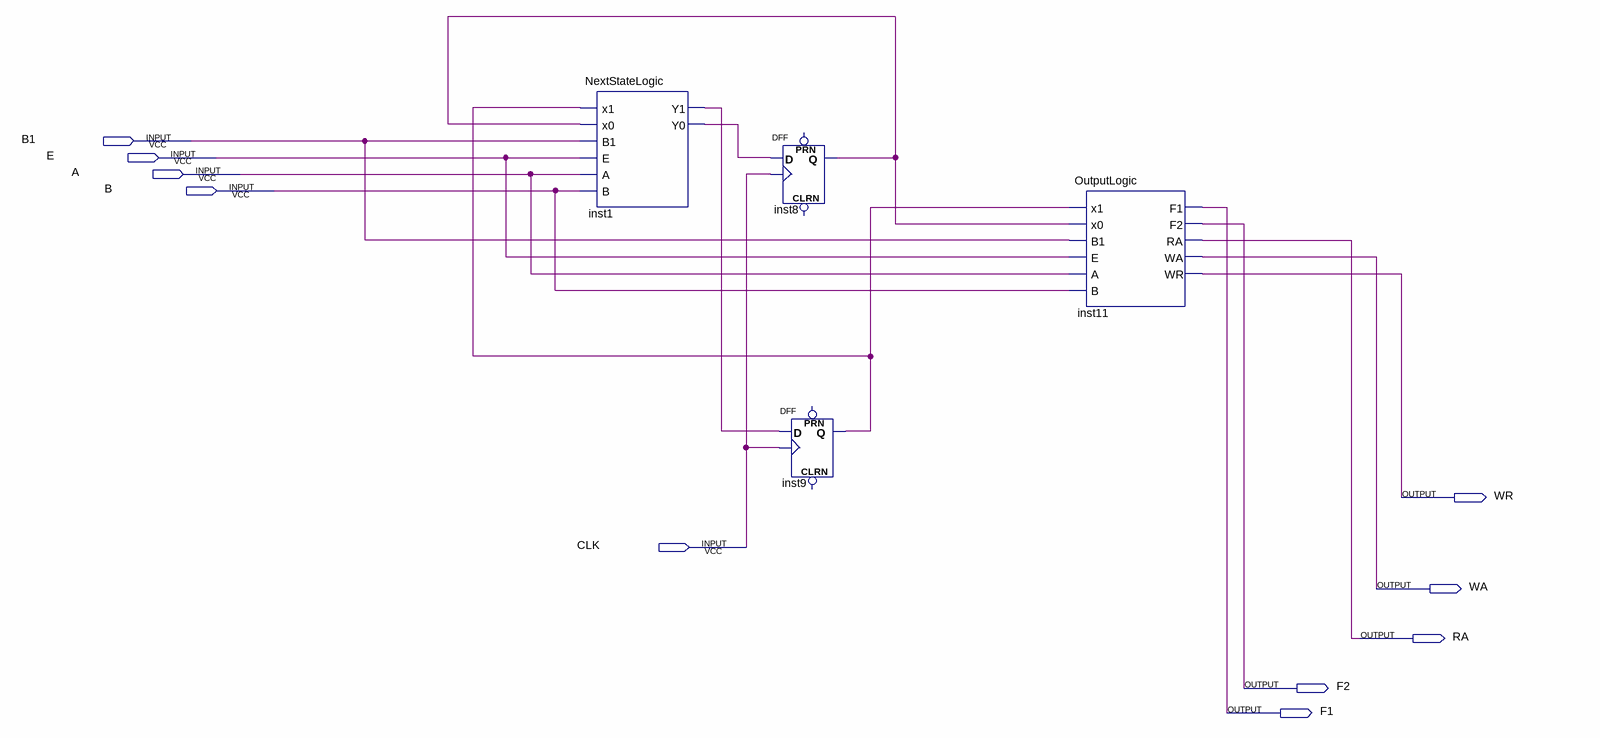
[diagram p0: schematic sheet]
// Quartus schematic FSM.bdf as structural Verilog: 4 symbols, 10 pins
module FSM (
  input  B1,
  input  E,
  input  A,
  input  B,
  input  CLK,
  output WR,
  output WA,
  output RA,
  output F2,
  output F1
);

  wire inst1_y0, inst1_y1, inst8_q, inst9_q;

  NextStateLogic inst1 (.x1(inst9_q), .x0(inst8_q), .B1(B1), .E(E), .A(A), .B(B), .Y1(inst1_y1), .Y0(inst1_y0));
  DFF inst8 (.CLK(CLK), .D(inst1_y0), .Q(inst8_q));  // open: CLRN, PRN
  DFF inst9 (.CLK(CLK), .D(inst1_y1), .Q(inst9_q));  // open: CLRN, PRN
  OutputLogic inst11 (
    .x1(inst9_q), .x0(inst8_q), .B1(B1), .E(E), .A(A), .B(B), .F1(F1), .F2(F2), .RA(RA), .WA(WA), .WR(WR));
endmodule
